# EAGLE design timetracker-1-8-rendered (EAGLE 7.5.0)
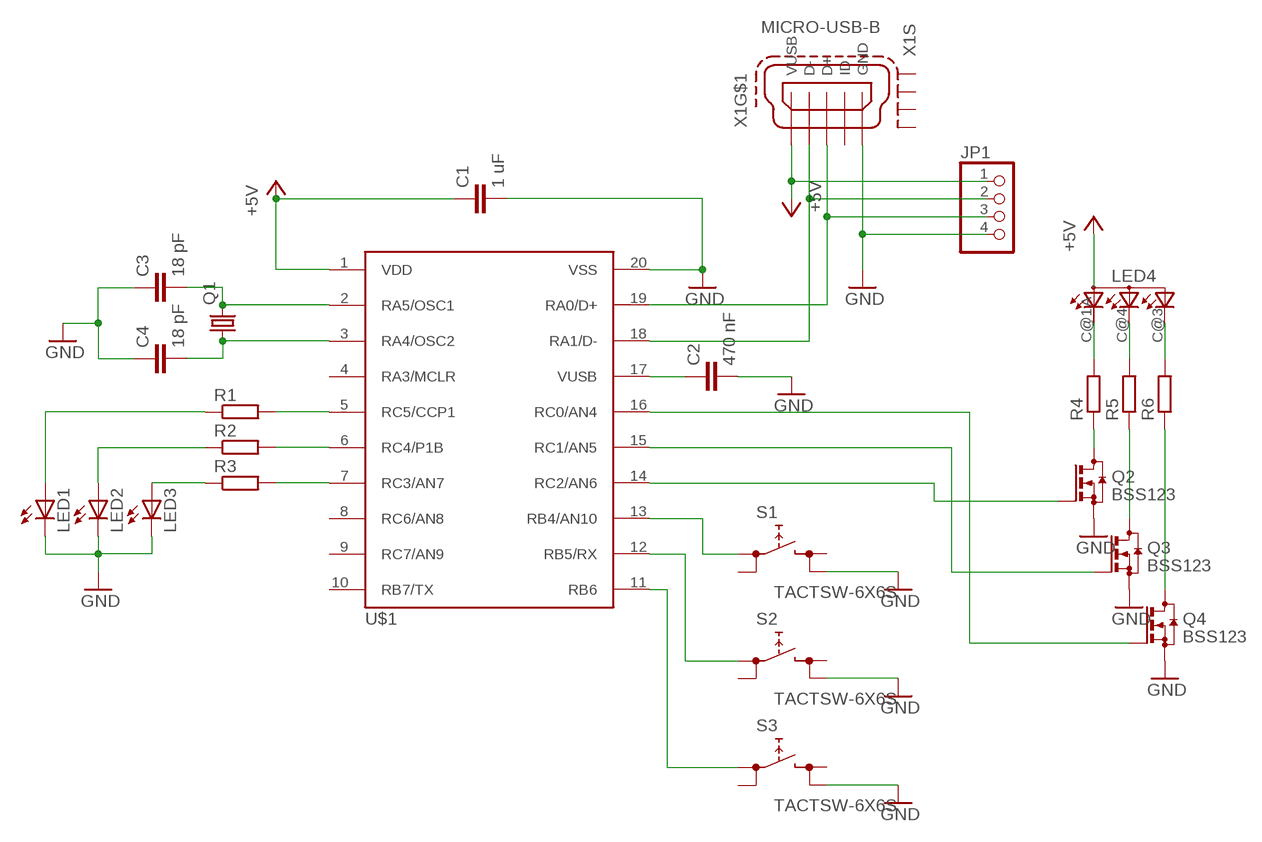
[diagram p0: schematic, sheet 1]

## Parts
C1  1 uF  C-EUC0805  [C0805]
C2  470 nF  C-EUC0805  [C0805]
C3  18 pF  C-EUC0805  [C0805]
C4  18 pF  C-EUC0805  [C0805]
JP1  PINHD-1X4  [1X04]
LED1  LEDSML0805  [SML0805]
LED2  LEDSML0805  [SML0805]
LED3  LEDSML0805  [SML0805]
LED4  RGBLED-3P-LCC-4  [P-LCC-4]
Q1  CRYSTALHC49UP  [HC49UP]
Q2  BSS123  [SOT23]
Q3  BSS123  [SOT23]
Q4  BSS123  [SOT23]
R1  R-EU_R0805  [R0805]
R2  R-EU_R0805  [R0805]
R3  R-EU_R0805  [R0805]
R4  R-EU_R0805  [R0805]
R5  R-EU_R0805  [R0805]
R6  R-EU_R0805  [R0805]
S1  TACTSW-6X6S  [TACTSW-6X6]
S2  TACTSW-6X6S  [TACTSW-6X6]
S3  TACTSW-6X6S  [TACTSW-6X6]
U$1  PIC18F14K50SMD  [DIL20-SMD]
X1  MICRO-USB-B  [MICRO-B-PAC]

## Nets
+5V: C1.1 JP1.1 LED4.A(A2) U$1.1(VDD) X1.1(VUSB)
GND: C1.2 C2.2 C3.1 C4.1 JP1.4 LED1.C LED2.C LED3.C Q2.2(S) Q3.2(S) Q4.2(S) S1.4(2.2) S2.4(2.2) S3.4(2.2) U$1.20(VSS) X1.5(GND)
N$1: JP1.3 U$1.19(RA0/D+) X1.3(D+)
N$2: C3.2 Q1.2 U$1.2(RA5/OSC1)
N$3: C2.1 U$1.17(VUSB)
N$4: C4.2 Q1.1 U$1.3(RA4/OSC2)
N$5: JP1.2 U$1.18(RA1/D-) X1.2(D-)
N$6: R3.2 U$1.7(RC3/AN7)
N$7: R2.2 U$1.6(RC4/P1B)
N$8: R1.2 U$1.5(RC5/CCP1)
N$9: LED1.A R1.1
N$10: LED2.A R2.1
N$11: LED3.A R3.1
N$12: LED4.C@1(CRED) R4.2
N$13: LED4.C@4(CGREEN) R5.2
N$14: S1.1(1.1) U$1.13(RB4/AN10)
N$15: S2.1(1.1) U$1.12(RB5/RX)
N$16: LED4.C@3(CBLUE) R6.2
N$17: Q2.3(D) R4.1
N$18: Q3.3(D) R5.1
N$19: Q4.3(D) R6.1
N$20: Q4.1(G) U$1.16(RC0/AN4)
N$21: Q3.1(G) U$1.15(RC1/AN5)
N$22: Q2.1(G) U$1.14(RC2/AN6)
N$23: S3.1(1.1) U$1.11(RB6)
Unconnected: S1.2(1.2) S1.3(2.1) S2.2(1.2) S2.3(2.1) S3.2(1.2) S3.3(2.1) U$1.4(RA3/MCLR) U$1.8(RC6/AN8) U$1.9(RC7/AN9) U$1.10(RB7/TX) X1.4(ID) X1.M1(S:S1) X1.M2(S:S2) X1.M3(S:S3) X1.M4(S:S4)

## Library data of the parts
C1-C4 = rcl:C-EU: CAPACITOR, European symbol
JP1 = pinhead:PINHD-1X4: PIN HEADER
LED1-LED3 = led:LED: LED OSRAM: - CHIPLED LG R971, LG N971, LY N971, LG Q971, LY Q971, LO R971, LY R971 LH N974, LH R974 LS Q976, LO Q976, LY Q976 LO Q996 - Hyper CHIPLED LW Q18S LB Q993, LB Q99A, LB R99A - SideLED LS A670, LO A670, LY A670, LG A670, LP A670 LB A673, LV A673, LT A673, LW A673 LH A674 LY A675 LS A676, LA A676, LO A676, LY A676, LW A676 LS A679, LY A679, LG A679 - Hyper Micro SIDELED® LS Y876, LA Y876, LO Y876, LY Y876 LT Y87S - SmartLED LW L88C, LW L88S LB L89C, LB L89S, LG L890 LS L89K, LO L89K, LY L89K LS L896, LA L896, LO L896, LY L896 - TOPLED LS T670, LO T670, LY T670, LG T670, LP T670 LSG T670, LSP T670, LSY T670, LOP T670, LYG T670 LG T671, LOG T671, LSG T671 LB T673, LV T673, LT T673, LW T673 LH T674 LS T676, LA T676, LO T676, LY T676, LB T676, LH T676, LSB T676, LW T676 LB T67C, LV T67C, LT T67C, LS T67K, LO T67K, LY T67K, LW E67C LS E67B, LA E67B, LO E67B, LY E67B, LB E67C, LV E67C, LT E67C LW T67C LS T679, LY T679, LG T679 LS T770, LO T770, LY T770, LG T770, LP T770 LB T773, LV T773, LT T773, LW T773 LH T774 LS E675, LA E675, LY E675, LS T675 LS T776, LA T776, LO T776, LY T776, LB T776 LHGB T686 LT T68C, LB T68C - Hyper Mini TOPLED® LB M676 - Mini TOPLED Santana® LG M470 LS M47K, LO M47K, LY M47K Source: http://www.osram.convergy.de LUXEON: - LUMILED® LXK2-PW12-R00, LXK2-PW12-S00, LXK2-PW14-U00, LXK2-PW14-V00 LXK2-PM12-R00, LXK2-PM12-S00, LXK2-PM14-U00 LXK2-PE12-Q00, LXK2-PE12-R00, LXK2-PE12-S00, LXK2-PE14-T00, LXK2-PE14-U00 LXK2-PB12-K00, LXK2-PB12-L00, LXK2-PB12-M00, LXK2-PB14-N00, LXK2-PB14-P00, LXK2-PB14-Q00 LXK2-PR12-L00, LXK2-PR12-M00, LXK2-PR14-Q00, LXK2-PR14-R00 LXK2-PD12-Q00, LXK2-PD12-R00, LXK2-PD12-S00 LXK2-PH12-R00, LXK2-PH12-S00 LXK2-PL12-P00, LXK2-PL12-Q00, LXK2-PL12-R00 Source: www.luxeon.com KINGBRIGHT: KA-3528ASYC Source: www.kingbright.com
LED4 = g-e2e-training:RGBLED-3: OSRAM - Hyper Multi TOPLED® (RGB) LB E673, LV E673, LT E673 - Power TOPLED® Enhanced optical Power LED (HOP2000) LS E67B, LA E67B, LO E67B, LY E67B - Hyper Multi TOPLED® Enhanced optical Power LED (HOP2000 / ATON®) LATB T66B - Hyper Multi TOPLED® Hyper-Bright LED LATB T686 Source: http://www.osram.convergy.de/
Q1 = g-e2e-training:CRYSTAL: CRYSTAL; OC_FARNELL: unknown; OC_NEWARK: unknown
Q2-Q4 = transistor-small-signal:BSS123: N-CHANNEL MOS FET
R1-R6 = rcl:R-EU_: RESISTOR, European symbol
S1-S3 = g-e2e-training:TACTSW-6X6: 6.2 X 6.5mm TACT Switch (SMD) Source: http://www3.alps.co.jp/WebObjects/catalog.woa/PDF/E/Switch/Tact/SKHM/SKHM.PDF
U$1 = pic18f14k50:PIC18F14K50
X1 = g-e2e-training:MICRO-USB-B: MINI USB-B Conector Source: www.cypressindustries.com

## Net classes
0 default: width 0.305 mm

## Board
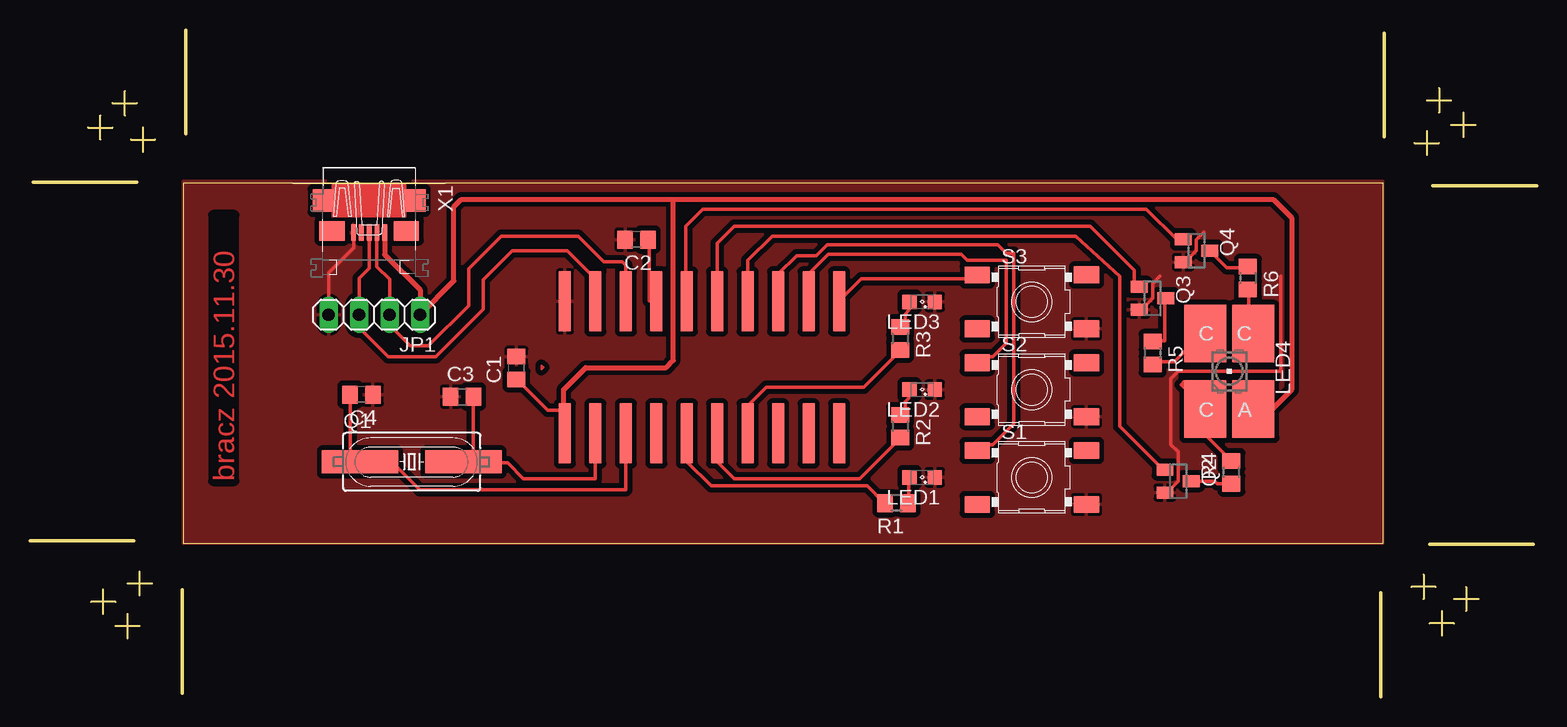
[diagram p1: board, top side]

Size 125.55 x 55.55 mm. Coordinates in mm from the lower left corner, seen from the top.
Outline: 8.91,42.85 0.28,42.85
Outline: 12.98,55.55 12.98,46.91
Outline: 4.85,47.42 6.88,47.42
Outline: 5.86,46.4 5.86,48.44
Outline: 6.88,49.45 8.91,49.45
Outline: 7.9,48.44 7.9,50.47
Outline: 8.4,46.4 10.44,46.4
Outline: 9.42,45.39 9.42,47.42
Outline: 112.85,46.63 112.85,55.27
Outline: 125.55,42.57 116.91,42.57
Outline: 117.42,50.7 117.42,48.67
Outline: 116.4,49.68 118.44,49.68
Outline: 119.45,48.67 119.45,46.63
Outline: 118.44,47.65 120.47,47.65
Outline: 116.4,47.14 116.4,45.11
Outline: 115.39,46.13 117.42,46.13
Outline: 12.7,8.91 12.7,0.28
Outline: 0,12.98 8.64,12.98
Outline: 8.13,4.85 8.13,6.88
Outline: 9.14,5.86 7.11,5.86
Outline: 6.1,6.88 6.1,8.91
Outline: 7.11,7.9 5.08,7.9
Outline: 9.14,8.4 9.14,10.44
Outline: 10.16,9.42 8.13,9.42
Outline: 116.63,12.7 125.27,12.7
Outline: 112.57,0 112.57,8.64
Outline: 120.7,8.13 118.67,8.13
Outline: 119.68,9.14 119.68,7.11
Outline: 118.67,6.1 116.63,6.1
Outline: 117.65,7.11 117.65,5.08
Outline: 117.14,9.14 115.11,9.14
Outline: 116.13,10.16 116.13,8.13
Outline: 12.77,12.77 112.77,12.77 112.77,42.77 12.77,42.77 12.77,12.77
Copper layers (1*16): Top 0.035mm / dielectric 1.5mm / Bottom 0.035mm
Design rules "default *": minimum track width 10mil, minimum drill 24mil, track to track 12mil, track to pad 12mil, pad to pad 8mil, via to via 8mil, smd to smd 8mil, copper to edge 0mil, drill to drill 8mil, minimum pad ring 10mil, minimum via ring 8mil, stop-mask expansion 4mil, vias tented up to drill 0mil, thermal gap 10mil

### Footprints (pad centres in the part's own frame; a part is rotated, then mirrored left to right if it is on the bottom)
C0805 = smd 1.3 x 1.5: 1 -0.95,0; 2 0.95,0
1X04 = drill 1.016 long: 1 -3.81,0; 2 -1.27,0; 3 1.27,0; 4 3.81,0
SML0805 = smd 1.2 x 1.2: A 1.05,0; C -1.05,0
P-LCC-4 = smd 3.5 x 4.8: A -2,3.15; C@1 2,3.15; C@3 -2,-3.15; C@4 2,-3.15
HC49UP = smd 6.35 x 1.93: 1 -4.318,0; 2 4.318,0
SOT23 = smd 1 x 1.4: 1 -0.95,-1.1; 2 0.95,-1.1; 3 0,1.1
R0805 = smd 1.3 x 1.5: 1 -0.95,0; 2 0.95,0
TACTSW-6X6 = smd 2.1 x 1.4: 1 -4.55,2.24; 2 4.55,2.25; 3 -4.55,-2.25; 4 4.55,-2.25
DIL20-SMD = smd 1 x 5: 1 -11.43,-5.5; 2 -8.89,-5.5; 3 -6.35,-5.5; 4 -3.81,-5.5; 5 -1.27,-5.5; 6 1.27,-5.5; 7 3.81,-5.5; 8 6.35,-5.5; 9 8.89,-5.5; 10 11.43,-5.5; 11 11.43,5.5; 12 8.89,5.5; 13 6.35,5.5; 14 3.81,5.5; 15 1.27,5.5; 16 -1.27,5.5; 17 -3.81,5.5; 18 -6.35,5.5; 19 -8.89,5.5; 20 -11.43,5.5
MICRO-B-PAC = smd 1.35 x 0.4: 1 2.675,1.3; 2 2.675,0.65; 3 2.675,0; 4 2.675,-0.65; 5 2.675,-1.3 | smd 1.9 x 1.8: M1 0,-3.8; M2 0,3.8 | smd 1.6 x 2.1: M3 2.55,3.1; M4 2.55,-3.1

### Placement (x,y rotation side)
C1  40.54,27.38 90 top
C2  50.54,38.08 180 top
C3  36,24.99 0 top
C4  27.63,25.17 180 top
JP1  28.69,31.82 180 top
LED1  74.34,18.26 180 top
LED2  74.34,25.58 180 top
LED3  74.34,32.89 180 top
LED4  99.95,27.1 180 top
Q1  31.81,19.56 0 top
Q2  95.68,17.96 270 top
Q3  93.55,33.2 270 top
Q4  97.2,37.16 270 top
R1  72.21,16.13 180 top
R2  72.51,22.53 270 top
R3  72.51,29.84 270 top
R4  100.12,18.69 90 top
R5  93.55,28.62 270 top
R6  101.5,34.88 270 top
S1  83.49,18.26 0 top
S2  83.49,25.58 0 top
S3  83.49,32.89 0 top
U$1  56,27.43 0 top
X1  28.26,41.34 270 top

### Tracks (layer width: path | path; a pad name or v marks a point on that pad's centre or on a via)
+5V
  Top 0.305: C1.1 40.61,26.39 43.15,23.85 44.37,23.85 U$1.1
  Top 0.406: X1.1 29.56,36.83 32.5,33.89 JP1.1 35.33,34.65 35.33,40.82 35.94,41.42 53.62,41.42 | 53.62,41.42 103.6,41.42 105.13,39.9 105.13,25.58 103.54,23.99 LED4.A | U$1.1 44.47,22.03 44.47,25.58 46.3,27.4 53.01,27.4 53.62,28.01 53.62,41.42
GND
  Top 0.305: X1.5 26.96,37.4 24.88,35.32 JP1.4 | Q4.2 96.25,36.21 97.2,37.16 97.2,38.07 97.81,38.68 | Q3.2 92.6,32.25 93.55,33.2 93.55,34.41 94.16,35.02 | Q2.2 94.73,17.01 95.68,17.96 95.68,20.39 95.07,21 95.07,26.49 95.68,27.1 104.21,27.1 104.21,35.02
  pour Top (isolate 0.406): 12.77,42.64 12.77,12.77 112.75,12.77 112.75,42.95 12.77,42.95
N$1
  Top 0.305: X1.3 28.26,35.7 27.42,34.86 JP1.3 27.4,31.8 27.4,30.76 29.84,28.32 33.8,28.32 37.77,32.28 37.77,34.72 40.21,37.16 44.78,37.16 47.11,34.83 U$1.19
N$2
  Top 0.305: C3.2 36.95,24.97 36.95,19.58 36.14,19.58 Q1.2 37.06,19.48 39.8,19.48 41.12,18.16 47.11,18.16 U$1.2
N$3
  Top 0.305: C2.1 51.58,38.07 51.58,32.99 52.09,32.99 U$1.17
N$4
  Top 0.305: C4.2 26.69,25.07 26.69,19.58 27.4,19.58 Q1.1 27.61,19.48 30.25,19.48 32.48,17.24 49.65,17.24 U$1.3
N$5
  Top 0.305: X1.2 28.91,35.81 29.96,34.76 JP1.2 29.96,30.94 31.67,29.23 33.2,29.23 36.55,32.59 36.55,35.63 39.29,38.38 45.69,38.38 47.83,36.24 49.35,36.24 49.65,35.94 U$1.18
N$6
  Top 0.305: R3.2 72.51,28.83 69.47,25.78 61.34,25.78 59.81,24.25 59.81,22.02 U$1.7
N$7
  Top 0.305: R2.2 72.51,21.51 69.16,18.16 58.7,18.16 57.27,19.58 U$1.6
N$8
  Top 0.305: R1.2 71.19,16.13 69.77,17.55 56.77,17.55 54.73,19.58 U$1.5
N$9
  Top 0.305: LED1.A 73.23,18.26 73.23,16.13 R1.1
N$10
  Top 0.305: LED2.A 73.23,25.58 73.23,24.86 72.92,24.56 72.92,23.54 72.51,23.54 R2.1
N$11
  Top 0.305: LED3.A 73.23,32.89 73.23,32.18 72.92,31.87 72.92,30.86 72.51,30.86 R3.1
N$12
  Top 0.305: R4.2 100.05,19.68 98.02,21.71 98.02,23.85 LED4.C@1
N$13
  Top 0.305: R5.2 93.55,27.71 93.75,27.91 95.37,27.91 97.71,30.25 97.91,30.25 LED4.C@4
N$14
  Top 0.305: S1.1 79.02,20.6 79.42,21 80.24,21 81.96,22.73 81.96,36.95 81.35,36.95 80.64,37.67 66.42,37.67 65.5,36.75 63.88,36.75 62.35,35.23 62.35,32.99 U$1.13
N$15
  Top 0.305: S2.1 79.02,27.91 79.42,28.32 80.24,28.32 81.35,29.44 81.35,36.34 78.1,36.34 77.59,36.85 66.52,36.85 64.89,35.23 64.89,32.99 U$1.12
N$16
  Top 0.305: R6.2 101.57,33.91 101.57,30.35 101.88,30.35 LED4.C@3
N$17
  Top 0.305: Q2.3 98.73,17.96 98.93,17.75 100.05,17.75 R4.1
N$18
  Top 0.305: Q3.3 94.56,33.2 94.56,29.64 93.55,29.64 R5.1
N$19
  Top 0.305: Q4.3 98.32,37.16 99.74,35.74 101.47,35.74 R6.1
N$20
  Top 0.305: U$1.16 54.63,33.03 54.63,39.19 56.06,40.61 93.04,40.61 95.54,38.11 Q4.1
N$21
  Top 0.305: Q3.1 92.02,34.57 92.02,35.53 88.36,39.19 58.7,39.19 57.27,37.76 U$1.15
N$22
  Top 0.305: Q2.1 94.42,18.91 90.8,22.53 90.8,35.02 87.14,38.38 61.85,38.38 59.81,36.34 U$1.14
N$23
  Top 0.305: S3.1 78.92,35.13 78.61,34.82 69.26,34.82 67.43,32.99 U$1.11

### Text on the board
Top: bracz 2015.11.30